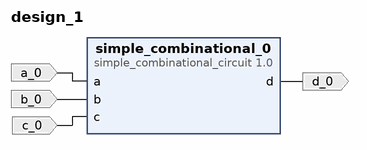
[diagram p0: block diagram of the top level]
# Vivado block design design_1, xc7z020clg484-1, Vivado 2019.2
create_bd_design design_1

create_bd_port -dir I -type data a_0
create_bd_port -dir I -type data b_0
create_bd_port -dir I -type data c_0
create_bd_port -dir O -type data d_0

create_bd_cell -type ip -vlnv xilinx.com:hls:simple_combinational_circuit:1.0 simple_combinational_0

# ---- connections ----

connect_bd_net -net a_0_1 [get_bd_ports a_0] [get_bd_pins simple_combinational_0/a]
connect_bd_net -net b_0_1 [get_bd_ports b_0] [get_bd_pins simple_combinational_0/b]
connect_bd_net -net c_0_1 [get_bd_ports c_0] [get_bd_pins simple_combinational_0/c]
connect_bd_net [get_bd_pins simple_combinational_0/d] [get_bd_ports d_0]

validate_bd_design
save_bd_design
